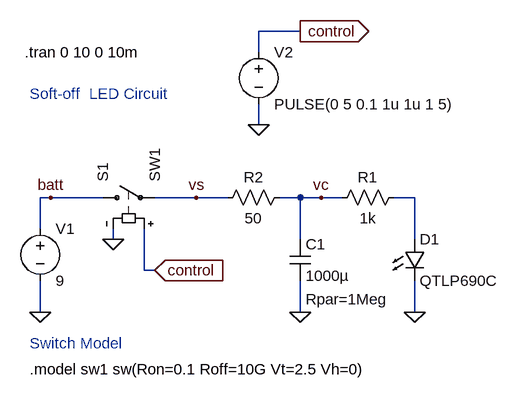
[diagram p0: schematic switched_LED.asc]
switched_LED.asc, the LTspice schematic file:
Version 4
SHEET 1 880 680
WIRE 288 -176 224 -176
WIRE 224 -144 224 -176
WIRE 224 -32 224 -64
WIRE -96 80 -112 80
WIRE -16 80 -96 80
WIRE 128 80 64 80
WIRE 176 80 128 80
WIRE 288 80 256 80
WIRE 320 80 288 80
WIRE 352 80 320 80
WIRE 464 80 432 80
WIRE -112 128 -112 80
WIRE 0 144 0 128
WIRE 288 144 288 80
WIRE 464 144 464 80
WIRE 48 192 48 128
WIRE 64 192 48 192
WIRE -112 256 -112 208
WIRE 288 256 288 208
WIRE 464 256 464 208
FLAG 464 256 0
FLAG 288 256 0
FLAG -112 256 0
FLAG 0 144 0
FLAG 224 -32 0
FLAG 288 -176 control
IOPIN 288 -176 Out
FLAG 64 192 control
IOPIN 64 192 In
FLAG 320 80 vc
FLAG 128 80 vs
FLAG -96 80 batt
SYMBOL voltage -112 112 R0
SYMATTR InstName V1
SYMATTR Value 9
SYMBOL LED 448 144 R0
SYMATTR InstName D1
SYMATTR Value QTLP690C
SYMATTR Description Diode
SYMATTR Type diode
SYMBOL res 336 96 R270
WINDOW 0 32 56 VTop 0
WINDOW 3 0 56 VBottom 0
SYMATTR InstName R1
SYMATTR Value 1k
SYMBOL cap 272 144 R0
WINDOW 39 24 92 Left 0
SYMATTR InstName C1
SYMATTR Value 1000µ
SYMATTR SpiceLine Rpar=1Meg
SYMBOL res 160 96 R270
WINDOW 0 32 56 VTop 0
WINDOW 3 0 56 VBottom 0
SYMATTR InstName R2
SYMATTR Value 50
SYMBOL sw -32 80 R270
SYMATTR InstName S1
SYMATTR Value SW1
SYMBOL voltage 224 -160 R0
WINDOW 123 0 0 Left 0
WINDOW 39 0 0 Left 0
SYMATTR InstName V2
SYMATTR Value PULSE(0 5 0.1 1u 1u 1 5)
TEXT -128 344 Left 0 !.model sw1 sw(Ron=0.1 Roff=10G Vt=2.5 Vh=0)
TEXT -136 -144 Left 0 !.tran 0 10 0 10m
TEXT -128 -80 Left 0 ;Soft-off  LED Circuit
TEXT -128 304 Left 0 ;Switch Model

The netlist it stands for:
* switched_LED.asc
V1 batt 0 9
D1 N001 0 QTLP690C
R1 vc N001 1k
C1 vc 0 1000µ Rpar=1Meg
R2 vs vc 50
S1 batt vs control 0 SW1
V2 control 0 PULSE(0 5 0.1 1u 1u 1 5)
.model D D
.lib standard.dio
.model sw1 sw(Ron=0.1 Roff=10G Vt=2.5 Vh=0)
.tran 0 10 0 10m
* Soft-off  LED Circuit
* Switch Model
.backanno
.end